# EAGLE design arduino_dojo_shield_rev01 (EAGLE 7.5.0)
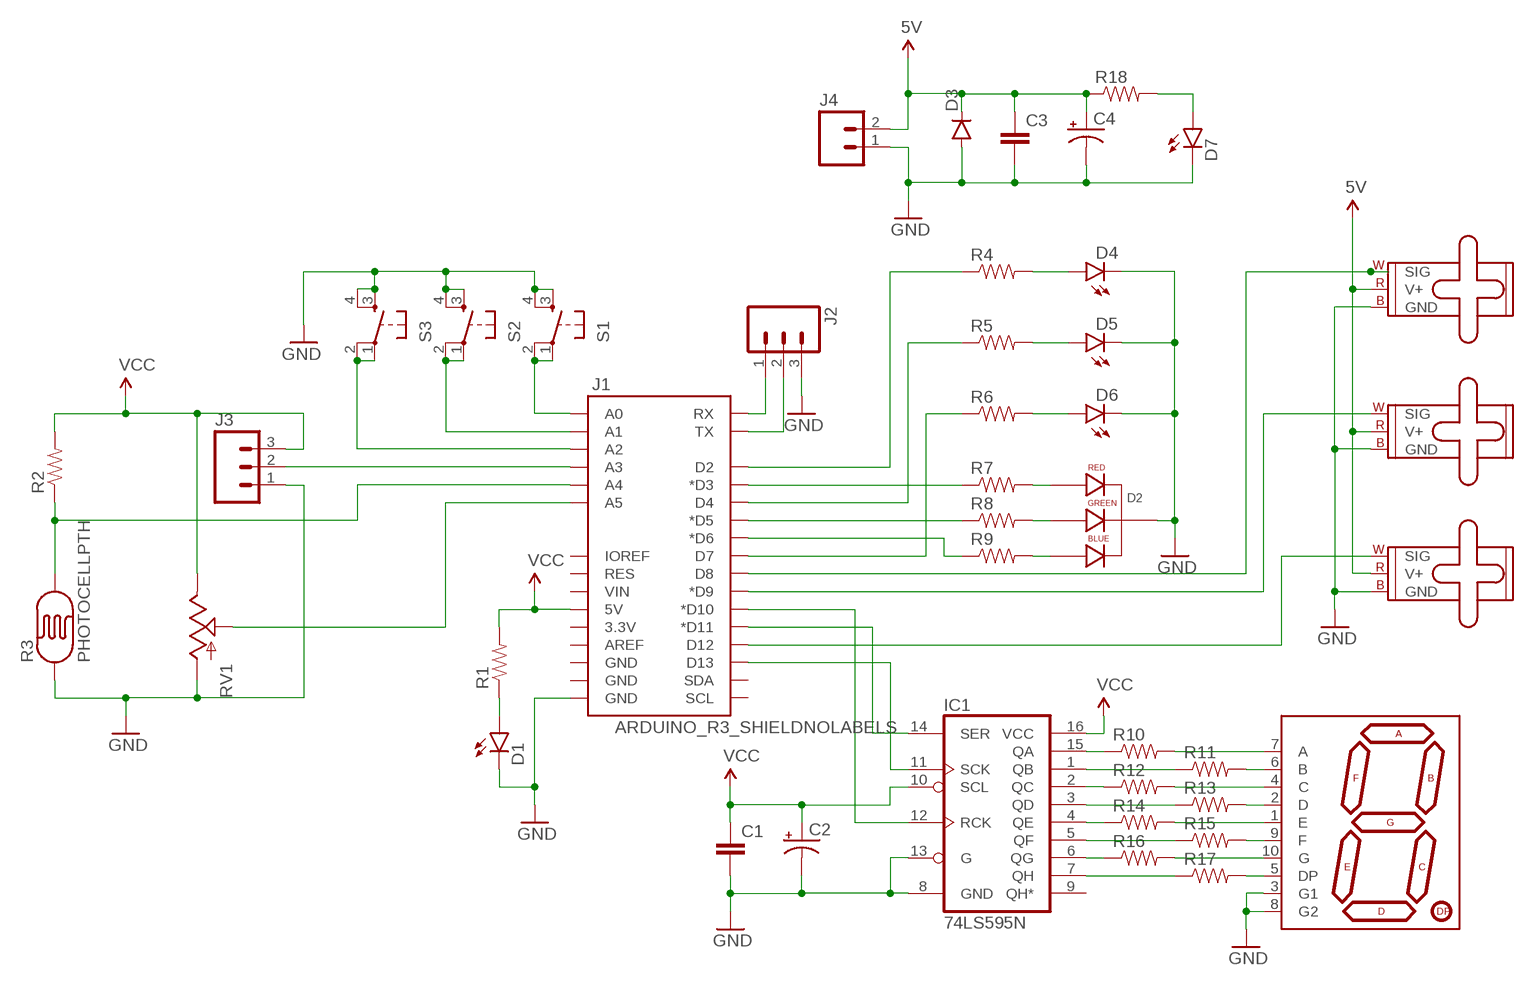
[diagram p0: schematic, sheet 1]

## Parts
C1  0.1UF-50V-20%(PTH)KIT-EZ  [CAP-PTH-SMALL-KIT]
C2  10UF-25V-20%(PTH)  [CPOL-RADIAL-10UF-25V]
C3  0.1UF-50V-20%(PTH)KIT-EZ  [CAP-PTH-SMALL-KIT]
C4  10UF-25V-20%(PTH)  [CPOL-RADIAL-10UF-25V]
D1  LED3MM  [LED3MM]
D2  LED-RGB-CC-THRUCLEAR  [LED-RGB-THRU]
D3  DIODEKIT  [DIODE-1N4148-KIT]
D4  LED3MM  [LED3MM]
D5  LED3MM  [LED3MM]
D6  LED3MM  [LED3MM]
D7  LED3MM  [LED3MM]
IC1  74LS595N  [DIL16]
J1  ARDUINO_R3_SHIELDNOLABELS  [UNO_R3_SHIELD_NOLABELS]
J2  M03PTH  [1X03]
J3  M03PTH  [1X03]
J4  M025MM  [SCREWTERMINAL-5MM-2]
M1  SMALL_SERVO  [1X03]
M2  SMALL_SERVO  [1X03]
M3  SMALL_SERVO  [1X03]
R1  RESISTOR0805-RES  [0805]
R2  RESISTORPTH-1/4W  [AXIAL-0.4]
R3  PHOTOCELLPTH  [PHOTOCELL]
R4  RESISTOR0805-RES  [0805]
R5  RESISTOR0805-RES  [0805]
R6  RESISTOR0805-RES  [0805]
R7  RESISTOR0805-RES  [0805]
R8  RESISTOR0805-RES  [0805]
R9  RESISTOR0805-RES  [0805]
R10  RESISTOR0805-RES  [0805]
R11  RESISTOR0805-RES  [0805]
R12  RESISTOR0805-RES  [0805]
R13  RESISTOR0805-RES  [0805]
R14  RESISTOR0805-RES  [0805]
R15  RESISTOR0805-RES  [0805]
R16  RESISTOR0805-RES  [0805]
R17  RESISTOR0805-RES  [0805]
R18  RESISTOR0805-RES  [0805]
RV1  POT-RV16AF-20  [POT_ALPHA_RV16AF-20]
S1  TAC_SWITCHPTH  [TACTILE-PTH]
S2  TAC_SWITCHPTH  [TACTILE-PTH]
S3  TAC_SWITCHPTH  [TACTILE-PTH]
U$1  7-SEGMENT-DISPLAYPTH  [7-SEGMENT-DISPLAY]

## Nets
5V: C3.1 C4.1(+) D3.C J4.2 M1.2(V+) M2.2(V+) M3.2(V+) R18.1
GND: C1.2 C2.2(-) C3.2 C4.2(-) D1.K(C) D2.2(CATHODE) D3.A D4.K(C) D5.K(C) D6.K(C) D7.K(C) IC1.8(GND) IC1.13(G) J1.GND@0(GND) J2.3 J3.1 J4.1 M1.3(GND) M2.3(GND) M3.3(GND) R3.1 RV1.1(A) S1.3 S1.4 S2.3 S2.4 S3.3 S3.4 U$1.3(G1) U$1.8(G2)
N$1: J1.A4 R2.P$1 R3.2
N$2: J1.A3 J3.2
N$3: IC1.4(QE) R14.1
N$4: J1.D6(*D6) R9.1
N$5: J1.D5(*D5) R8.1
N$6: J1.RX J2.1
N$7: J1.TX J2.2
N$8: J1.D3(*D3) R7.1
N$9: D2.1(RED_CATHODE) R7.2
N$10: D2.3(GREEN_CATHODE) R8.2
N$11: D2.4(BLUE_CATHODE) R9.2
N$12: J1.D7 R6.1
N$13: IC1.11(SCK) J1.D13
N$14: IC1.15(QA) R10.1
N$15: R10.2 U$1.7(A)
N$16: J1.D12 M2.1(SIG)
N$17: J1.D9(*D9) M1.1(SIG)
N$18: IC1.1(QB) R11.1
N$19: R11.2 U$1.6(B)
N$20: IC1.2(QC) R12.1
N$21: R12.2 U$1.4(C)
N$22: IC1.3(QD) R13.1
N$23: R13.2 U$1.2(D)
N$24: IC1.14(SER) J1.D11(*D11)
N$25: R14.2 U$1.1(E)
N$26: IC1.5(QF) R15.1
N$27: R15.2 U$1.9(F)
N$28: IC1.6(QG) R16.1
N$29: R16.2 U$1.10(G)
N$30: IC1.7(QH) R17.1
N$31: R17.2 U$1.5(DP)
N$32: J1.D8 M3.1(SIG)
N$33: D7.A R18.2
N$35: J1.A1 S2.1 S2.2
N$36: J1.A2 S3.1 S3.2
N$37: J1.A0 S1.1 S1.2
N$38: D1.A R1.1
N$39: J1.A5 RV1.2(S)
N$40: D5.A R5.2
N$41: D6.A R6.2
N$42: D4.A R4.2
N$43: J1.D4 R5.1
N$44: J1.D2 R4.1
N$45: IC1.12(RCK) J1.D10(*D10)
VCC: C1.1 C2.1(+) IC1.10(SCL) IC1.16(VCC) J1.5V J3.3 R1.2 R2.P$2 RV1.3(E)
Unconnected: IC1.9(QH*) J1.3.3V J1.AREF J1.GND@1(GND) J1.GND@2(GND) J1.IOREF J1.RES J1.SCL J1.SDA J1.VIN

## Library data of the parts
C1 C3 = SparkFun-Capacitors:0.1UF-50V-20%(PTH): CAP-08370; PROD_ID: CAP-08370
C2 C4 = SparkFun-Capacitors:10UF-25V-20%(PTH): CAP-08440; PROD_ID: CAP-08440
D1 D4-D7 = SparkFun-LED:LED: LEDs Standard schematic elements and footprints for 5mm, 3mm, 1206, and 0603 sized LEDs. 5mm - Spark Fun Electronics SKU : COM-00529 (and others); PROD_ID: DIO-08794
D2 = SparkFun-LED:LED-RGB-CC-THRU: RGB Through-hole common cathode LED SparkFun Storefront: COM-00105 (Clear) COM-09264 (Diffuse); PROD_ID: DIO-08418
D3 = SparkFun-DiscreteSemi:DIODE: Diode These are standard reverse protection diodes and small signal diodes. SMA package can handle up to about 1A. SOD-323 can handle about 200mA. What the SOD-323 package when ordering, there are some mfgs out there that are 5-pin packages.
IC1 = SparkFun-DigitalIC:74*595: 8-bit SHIFT REGISTER, output latch
J1 = GH_SparkFun-Boards:ARDUINO_R3_SHIELD: Shield form compatible with the Arduino Uno R3.
J2 J3 = SparkFun-Connectors:M03: Header 3 Standard 3-pin 0.1" header. Use with straight break away headers (SKU : PRT-00116), right angle break away headers (PRT-00553), swiss pins (PRT-00743), machine pins (PRT-00117), and female headers (PRT-00115). Molex polarized connector foot print use with SKU : PRT-08232 with associated crimp pins and housings.
J4 = SparkFun-Connectors:M02: Standard 2-pin 0.1" header. Use with - straight break away headers ( PRT-00116) - right angle break away headers (PRT-00553) - swiss pins (PRT-00743) - machine pins (PRT-00117) - female headers (PRT-00115) Molex polarized connector foot print use with: PRT-08233 with associated crimp pins and housings. 2.54_SCREWTERM for use with PRT-10571. 3.5mm Screw Terminal footprints for PRT-08084 5mm Screw Terminal footprints for use with PRT-08432; STOREFRONT_ID: PRT-08432
M1-M3 = GH_SparkFun-Electromechanical:SMALL_SERVO: Small servo motor This is the small servo used in the SIK. SKU: ROB-09065
R1 R2 R4-R18 = SparkFun-Passives:RESISTOR: Resistor Basic schematic elements and footprints for 0603, 1206, and PTH resistors.
R3 = SparkFun-Sensors:PHOTOCELL: CdS photoresistor. This is a low cost way to detect light levels. Resistance decreases with more incoming light. SparkFun SKU: SEN-09088
RV1 = SparkFun-Electromechanical:POT
S1-S3 = SparkFun-Retired:TAC_SWITCH: Momentary Switch Button commonly used for reset or general input. Spark Fun Electronics SKU : COM-00097 SMT- SWCH-08247
U$1 = SparkFun-Displays:7-SEGMENT-DISPLAY

## Board
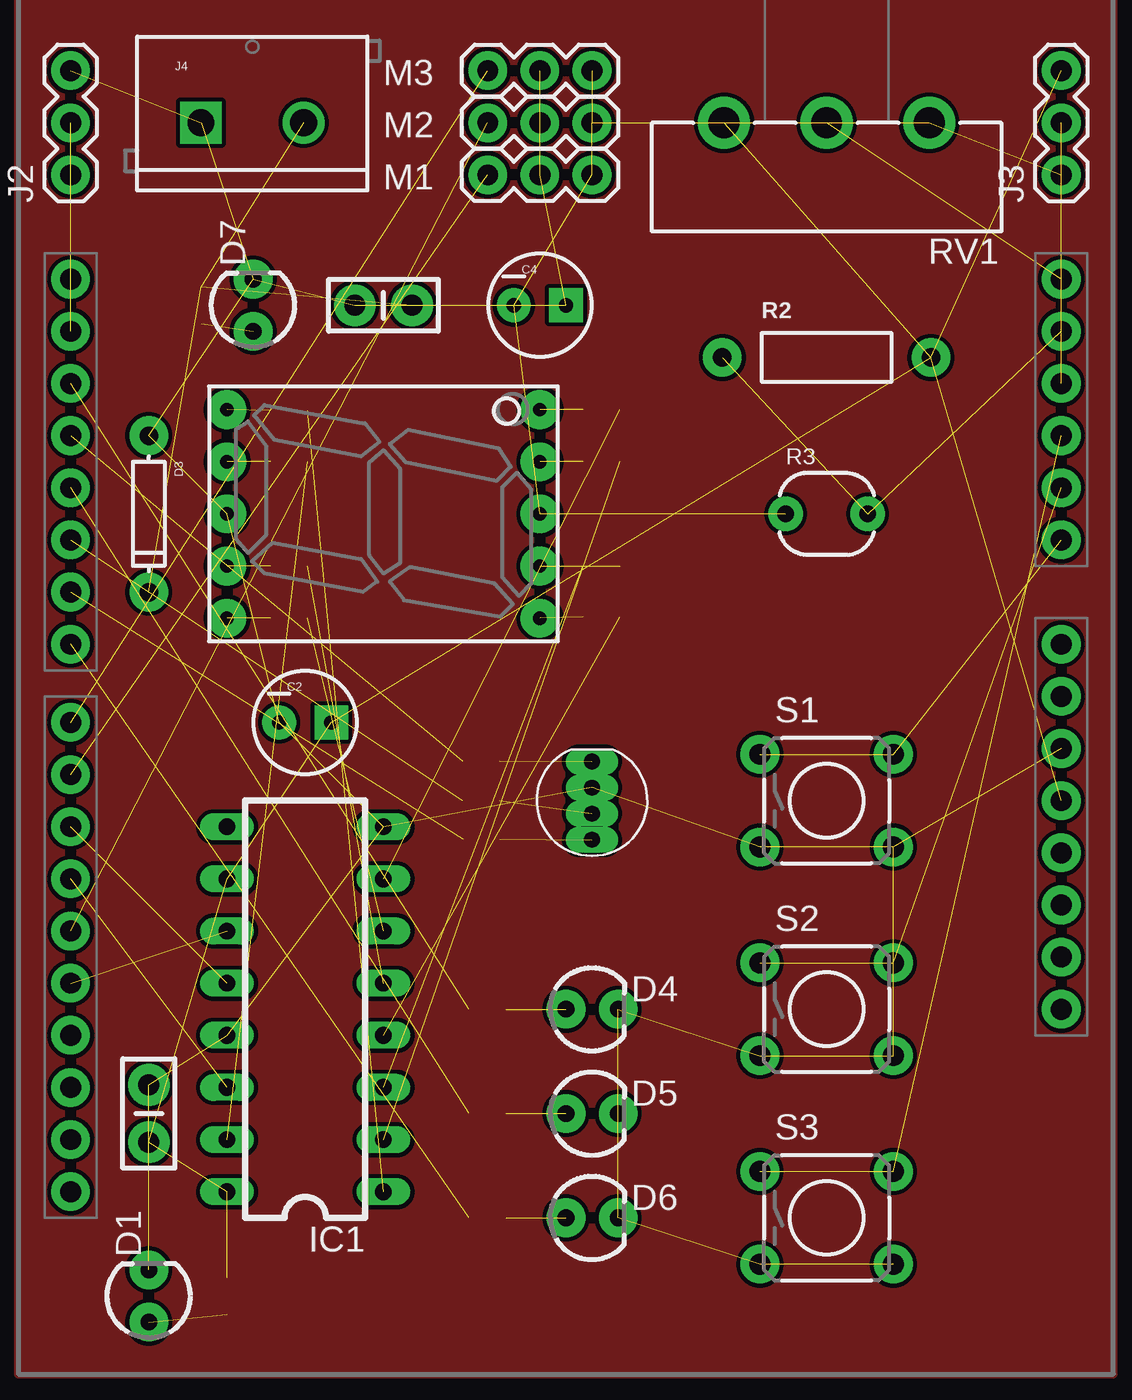
[diagram p1: board, top side]
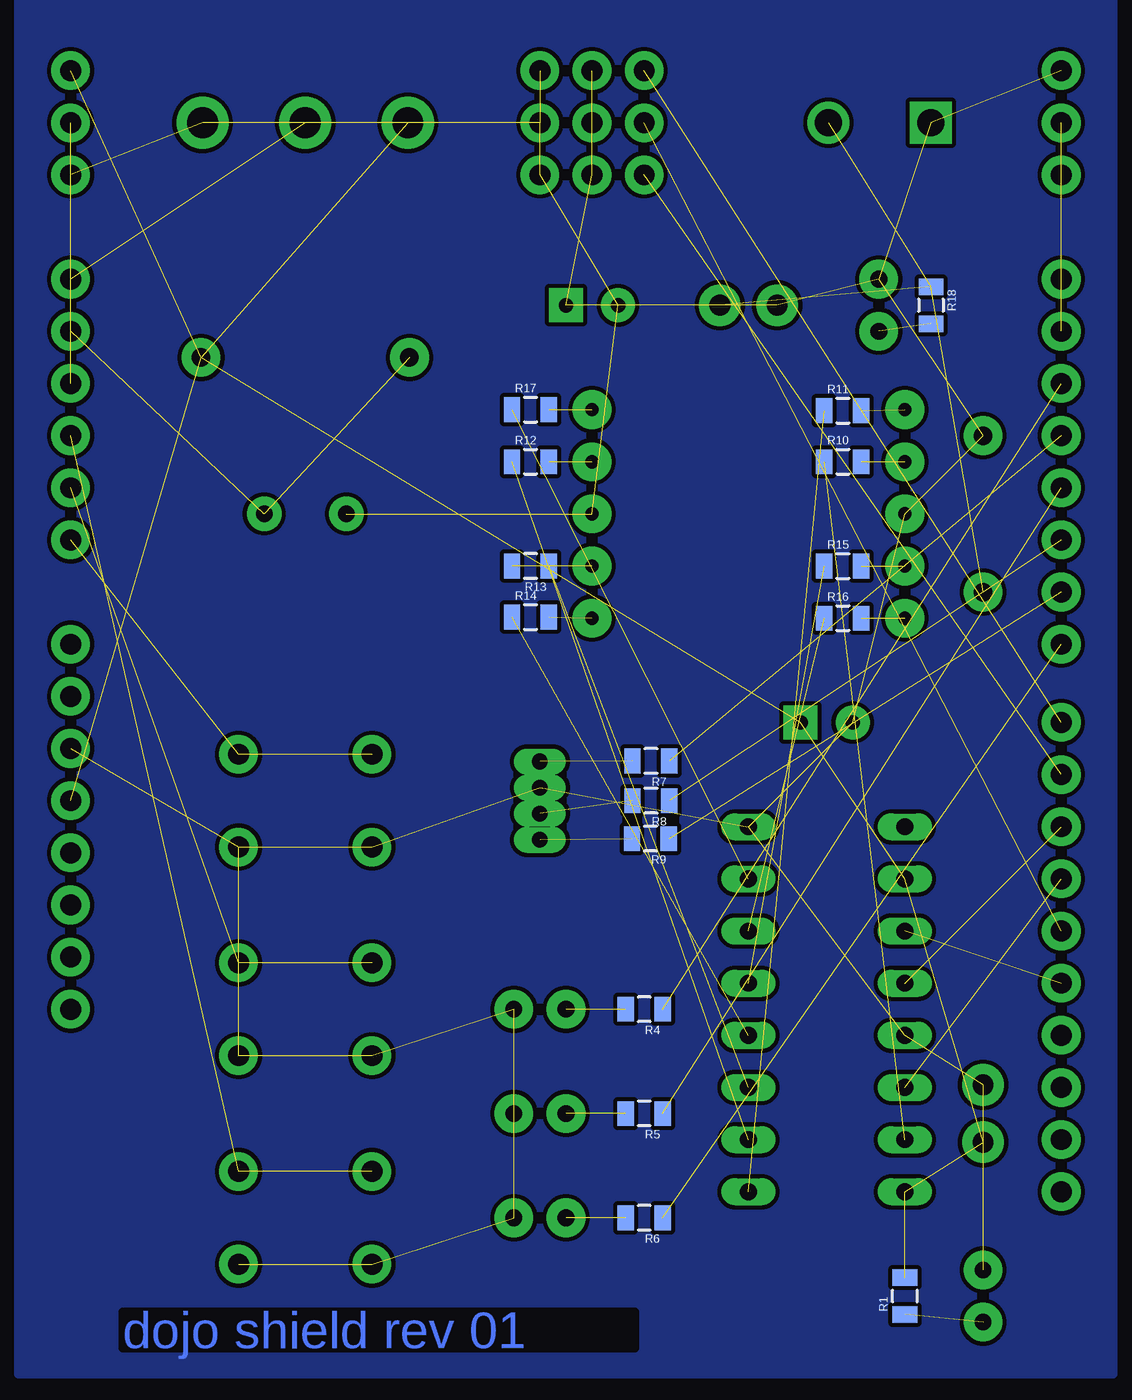
[diagram p2: board, bottom side, seen from below]

No outline drawn. Coordinates in mm, seen from the top.
Copper layers (1*16): Top 0.035mm / dielectric 1.5mm / Bottom 0.035mm
Design rules "default": minimum track width 10mil, minimum drill 24mil, track to track 8mil, track to pad 8mil, pad to pad 8mil, via to via 8mil, smd to smd 8mil, copper to edge 40mil, drill to drill 8mil, minimum pad ring 10mil, minimum via ring 8mil, stop-mask expansion 4mil, vias tented up to drill 0mil, thermal gap 10mil

### Footprints (pad centres in the part's own frame; a part is rotated, then mirrored left to right if it is on the bottom)
CAP-PTH-SMALL-KIT = drill 1.016 pad 2.032: 1 -1.397,0; 2 1.397,0
CPOL-RADIAL-10UF-25V = drill 0.7 pad 1.651 square: 1 1.27,0 | drill 0.7 pad 1.651: 2 -1.27,0
LED3MM = drill 0.813 pad 1.88: A -1.27,0; K 1.27,0
LED-RGB-THRU = drill 0.762 pad 0.889 long: 1 1.905,0; 2 0.635,0; 3 -0.635,0; 4 -1.905,0
DIODE-1N4148-KIT = drill 0.9 pad 1.88: A -3.81,0; C 3.81,0
DIL16 = drill 0.813 long: 1 -8.89,-3.81; 2 -6.35,-3.81; 3 -3.81,-3.81; 4 -1.27,-3.81; 5 1.27,-3.81; 6 3.81,-3.81; 7 6.35,-3.81; 8 8.89,-3.81; 9 8.89,3.81; 10 6.35,3.81; 11 3.81,3.81; 12 1.27,3.81; 13 -1.27,3.81; 14 -3.81,3.81; 15 -6.35,3.81; 16 -8.89,3.81
UNO_R3_SHIELD_NOLABELS = drill 1.016 pad 1.88: 3.3V 50.8,26.67; 5V 50.8,29.21; A0 50.8,41.91; A1 50.8,44.45; A2 50.8,46.99; A3 50.8,49.53; A4 50.8,52.07; A5 50.8,54.61; AREF 2.54,15.24; D2 2.54,49.53; D3 2.54,46.99; D4 2.54,44.45; D5 2.54,41.91; D6 2.54,39.37; D7 2.54,36.83; D8 2.54,33.02; D9 2.54,30.48; D10 2.54,27.94; D11 2.54,25.4; D12 2.54,22.86; D13 2.54,20.32; GND@0 50.8,31.75; GND@1 50.8,34.29; GND@2 2.54,17.78; IOREF 50.8,21.59; NC 50.8,19.05; RES 50.8,24.13; RX 2.54,54.61; SCL 2.54,10.16; SDA 2.54,12.7; TX 2.54,52.07; VIN 50.8,36.83
1X03 = drill 1.016 pad 1.88: 1 0,0; 2 2.54,0; 3 5.08,0
SCREWTERMINAL-5MM-2 = drill 1.3 pad 2.032 square: 1 0,0 | drill 1.3 pad 2.032: 2 5,0
0805 = smd 0.8 x 1.2: 1 -0.9,0; 2 0.9,0
AXIAL-0.4 = drill 0.9 pad 1.88: P$1 -5.08,0; P$2 5.08,0
PHOTOCELL = drill 0.8 pad 1.676: 1 -2,0; 2 2,0
POT_ALPHA_RV16AF-20 = drill 1.5 pad 2.54: 1 -5,0; 2 0,0; 3 5,0
TACTILE-PTH = drill 1.016 pad 1.88: 1 -3.251,2.261; 2 3.251,2.261; 3 -3.251,-2.261; 4 3.251,-2.261
7-SEGMENT-DISPLAY = drill 0.65 pad 1.88: 1 -5.08,-7.62; 2 -2.54,-7.62; 3 0,-7.62; 4 2.54,-7.62; 5 5.08,-7.62; 6 5.08,7.62; 7 2.54,7.62; 8 0,7.62; 9 -2.54,7.62; 10 -5.08,7.62

### Placement (x,y rotation side)
C1  6.35,13.97 90 top
C2  13.97,33.02 0 top
C3  17.78,53.34 180 top
C4  25.4,53.34 0 top
D1  6.35,5.08 90 top
D2  27.94,29.21 90 top
D3  6.35,43.18 270 top
D4  27.94,19.05 0 top
D5  27.94,13.97 0 top
D6  27.94,8.89 0 top
D7  11.43,53.34 90 top
IC1  13.97,19.05 90 top
J1  0,0 0 top
J2  2.54,59.69 90 top
J3  50.8,59.69 90 top
J4  8.89,62.23 0 top
M1  22.86,59.69 0 top
M2  22.86,62.23 0 top
M3  22.86,64.77 0 top
R1  10.16,5.08 90 bottom
R2  39.37,50.8 0 top
R3  39.37,43.18 0 top
R4  22.86,19.05 180 bottom
R5  22.86,13.97 180 bottom
R6  22.86,8.89 180 bottom
R7  22.53,31.14 180 bottom
R8  22.53,29.21 180 bottom
R9  22.56,27.36 180 bottom
R10  13.18,45.72 0 bottom
R11  13.18,48.21 0 bottom
R12  28.4,45.72 0 bottom
R13  28.4,40.64 180 bottom
R14  28.4,38.15 0 bottom
R15  13.18,40.64 0 bottom
R16  13.18,38.1 0 bottom
R17  28.4,48.26 0 bottom
R18  8.89,53.34 270 bottom
RV1  39.37,62.23 180 top
S1  39.37,29.21 0 top
S2  39.37,19.05 0 top
S3  39.37,8.89 0 top
U$1  17.78,43.18 90 top

### Tracks (layer width: path | path; a pad name or v marks a point on that pad's centre or on a via)
5V  (7 unrouted)
GND  (29 unrouted)
N$1  (2 unrouted)
N$2  (1 unrouted)
N$3  (1 unrouted)
N$4  (1 unrouted)
N$5  (1 unrouted)
N$6  (1 unrouted)
N$7  (1 unrouted)
N$8  (1 unrouted)
N$9  (1 unrouted)
N$10  (1 unrouted)
N$11  (1 unrouted)
N$12  (1 unrouted)
N$13  (1 unrouted)
N$14  (1 unrouted)
N$15  (1 unrouted)
N$16  (1 unrouted)
N$17  (1 unrouted)
N$18  (1 unrouted)
N$19  (1 unrouted)
N$20  (1 unrouted)
N$21  (1 unrouted)
N$22  (1 unrouted)
N$23  (1 unrouted)
N$24  (1 unrouted)
N$25  (1 unrouted)
N$26  (1 unrouted)
N$27  (1 unrouted)
N$28  (1 unrouted)
N$29  (1 unrouted)
N$30  (1 unrouted)
N$31  (1 unrouted)
N$32  (1 unrouted)
N$33  (1 unrouted)
N$34
  pour Bottom: 0,1.27 53.34,1.27 53.34,68.58 0,68.58
N$35  (2 unrouted)
N$36  (2 unrouted)
N$37  (2 unrouted)
N$38  (1 unrouted)
N$39  (1 unrouted)
N$40  (1 unrouted)
N$41  (1 unrouted)
N$42  (1 unrouted)
N$43  (1 unrouted)
N$44  (1 unrouted)
N$45  (1 unrouted)
N$46
  pour Top: 0,68.58 53.34,68.58 53.34,1.27 0,1.27
VCC  (8 unrouted)

### Text on the board
Bottom: dojo shield rev 01